# EasyEDA schematic 1-Schematic_dirty_video_mixer.json
TITLE: Dirty Video Mixer; REV: 1.0; Date: 2025-02-18; Sheet: 1/1; Drawn By: Tilman; Company: TekNoiseLab
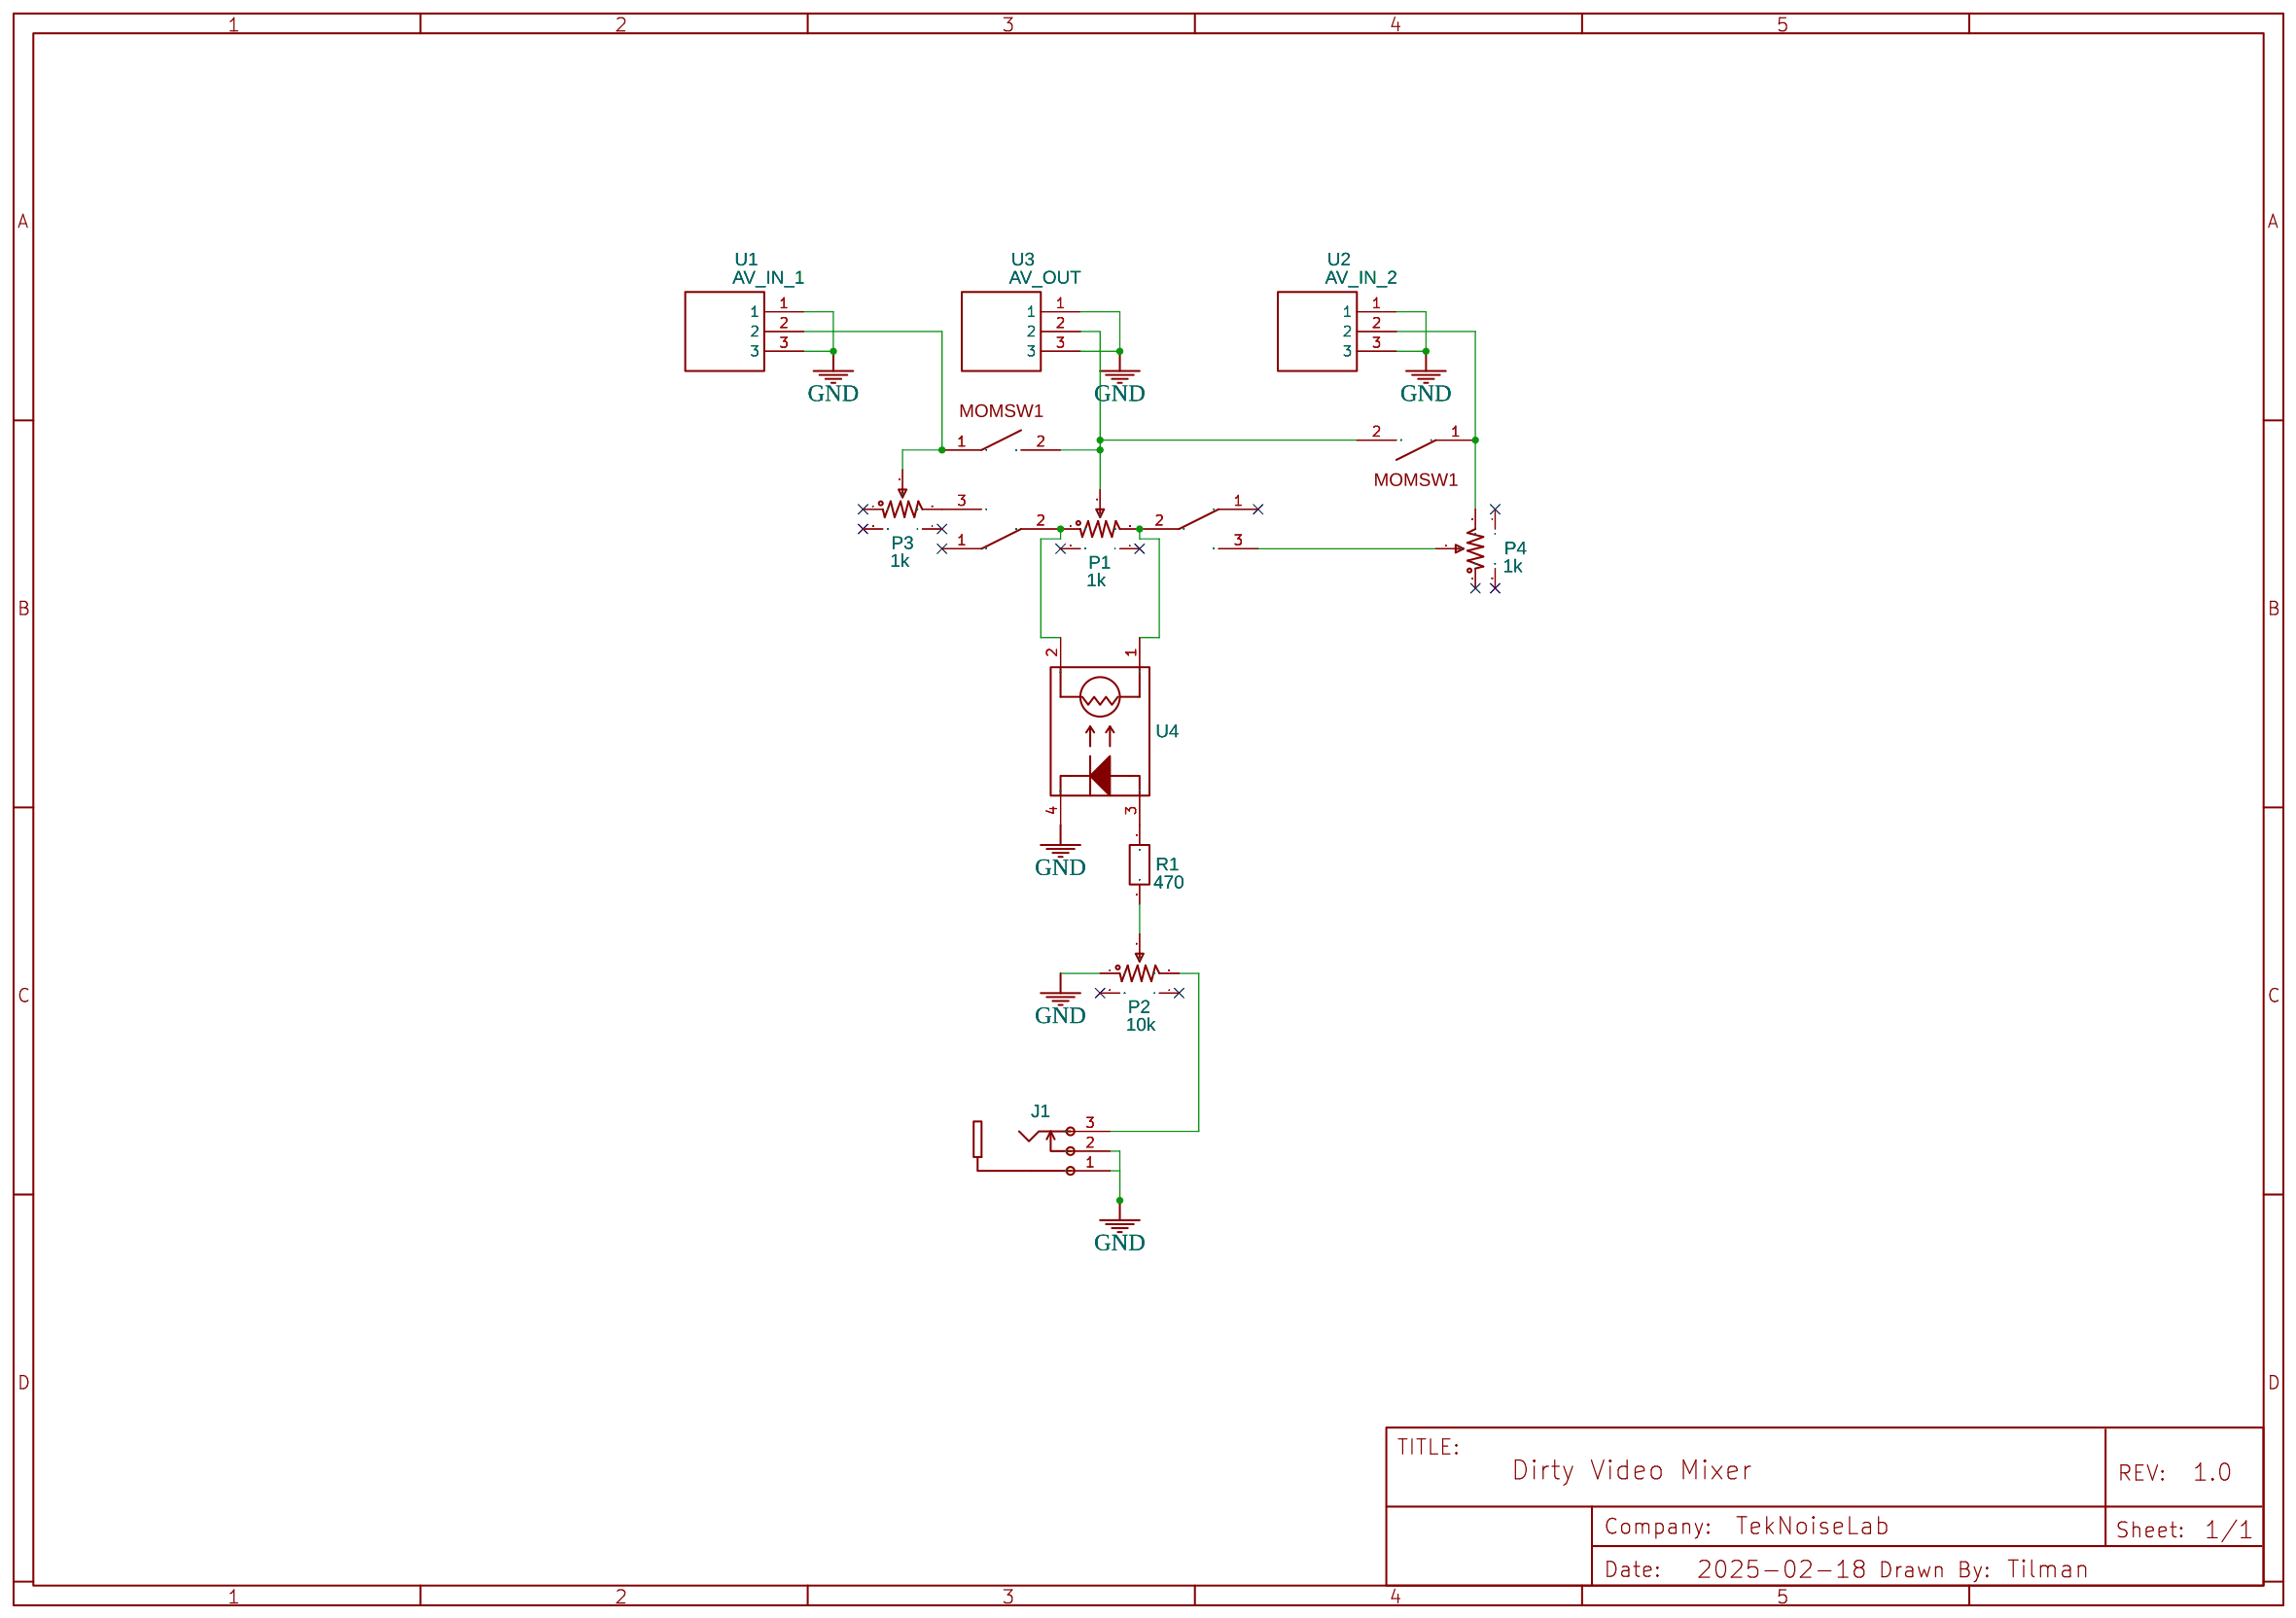
[diagram p0: schematic sheet]

## Parts
J1  DESTROY  [PJ-301M]
P1  1k  [RES-TH_RK09K1130AAU]
P2  10k  [RES-TH_RK09K1130AAU]
P3  1k  [RES-TH_RK09K1130AAU]
P4  1k  [RES-TH_RK09K1130AAU]
R1  470  [RES-TH_BD2.4-L6.3-P10.30-D0.6]
SW1  MTS102 TOGGLE SWITCH  [MTS102]
SW2  MTS102 TOGGLE SWITCH  [MTS102]
SW3  MOM1  [N.O. SPST MOMENTARY SWITCH (6MM)]
SW4  MOM2  [N.O. SPST MOMENTARY SWITCH (6MM)]
U1  AV_IN_1  [RCA_FEMALE]
U2  AV_IN_2  [RCA_FEMALE]
U3  AV_OUT  [RCA_FEMALE]
U4  VTL5C8  [OPTO-TH_4P-L12.4-W10.5-2.50-S3.50]

## Library data of the parts
J1 = PJ-301M: Supplier: Various; Contributor: Ed Random
P1-P4 = RK09K1130081: Supplier: LCSC; Supplier Part: C470311; Manufacturer: ALPSALPINE(阿尔卑斯阿尔派); JLCPCB Part Class: Extended Part; Contributor: lcsc
R1 = Res_AXIAL-0.4(1/4W)_US
SW1 SW2 = MTS102 TOGGLE SWITCH: Supplier: ALIEXPRESS; Contributor: Bassman_1980
SW3 SW4 = N.O. MOMENTARY SWITCH (6MM): Contributor: everestdesign7
U1-U3 = RCA_Female: Supplier: Digi-Key; Contributor: gellis
U4 = VTL5C8: Contributor: LCSC; Supplier: LCSC; Supplier Part: C9900003378; Manufacturer: null

## Nets
GND: J1.1 J1.2 P2.1 U1.1 U1.3 U2.1 U2.3 U3.1 U3.3 U4.4(C)
Net-(J1-3): J1.3 P2.3
Net-(P1-1): P1.1 SW1.2 U4.2
Net-(P1-2): P1.2 SW3.2 SW4.2 U3.2
Net-(P1-3): P1.3 SW2.2 U4.1
Net-(P2-2): P2.2 R1.2
Net-(P3-2): P3.2 SW3.1 U1.2
Net-(P3-3): P3.3 SW1.3
Net-(P4-2): P4.2 SW2.3
Net-(P4-3): P4.3 SW4.1 U2.2
Net-(R1-1): R1.1 U4.3(A)

Not connected (* = marked no-connect by the designer): P1 4* 5*; P2 4* 5*; P3 1* 4* 5*; P4 1* 4* 5*; SW1 1*; SW2 1*
